# Altium schematic sheet HV Interlock Circuit.SchDoc: Power Distrubition Unit LV
size A4; Date: 5.03.2019; Author: Sedat Kudak; CompanyName: Gunsel; Organization: GÜNSEL; Address1: Near East Boulevard; Address2: 99010; Address3: Lefkosa,TRNC; Address4: www.gunsel.com.tr; SheetNumber: 1; SheetTotal: 1
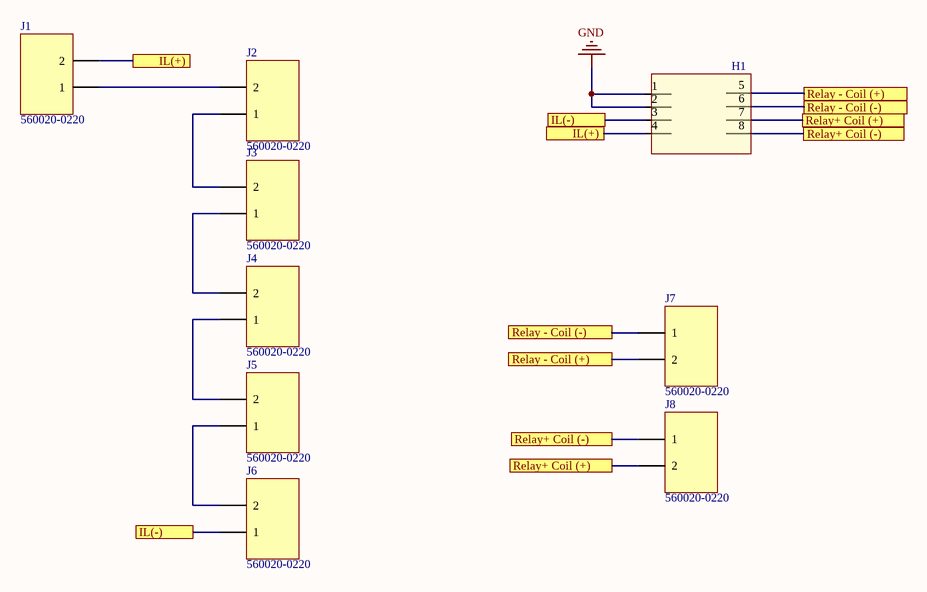
[diagram p0: HV Interlock Circuit.SchDoc]

## Parts
H1  TE-1379684-1  [TE-1379684-1]  (value not drawn)
J1  560020-0220  [560020-0220]
J2  560020-0220  [560020-0220]
J3  560020-0220  [560020-0220]
J4  560020-0220  [560020-0220]
J5  560020-0220  [560020-0220]
J6  560020-0220  [560020-0220]
J7  560020-0220  [560020-0220]
J8  560020-0220  [560020-0220]

## Ports
IL(+), IL(-), Relay - Coil (+), Relay - Coil (-), Relay+ Coil (+), Relay+ Coil (-)

## Nets
GND: H1.1(K) H1.2(K)
IL(+): H1.4(K) J1.2 ; port IL(+)
IL(-): H1.3(K) J6.1 ; port IL(-)
Relay - Coil (+): H1.5(K) J7.2 ; port Relay - Coil (+)
Relay - Coil (-): H1.6(K) J7.1 ; port Relay - Coil (-)
Relay+ Coil (+): H1.7(K) J8.2 ; port Relay+ Coil (+)
Relay+ Coil (-): H1.8(K) J8.1 ; port Relay+ Coil (-)
NetJ1_1: J1.1 J2.2
NetJ2_1: J2.1 J3.2
NetJ3_1: J3.1 J4.2
NetJ4_1: J4.1 J5.2
NetJ5_1: J5.1 J6.2

## Notes on the sheet
- Author:
- Title
- Date:
- Time:
- Checked By:
- Size:
- A4
- Rev:
- /
- File:

## Library data of the parts
J1-J8 = 560020-0220: CONN HEADER SMD 2POS 2MM; Manufacturer: Molex; Number of Positions: 2; Connector Type: Male Pin; Gender: Male; Pitch: 0.079inch; Glow Wire Compliant: Non-compliant; Supplier 1: Digi-Key; Manufacturer Part Number: 560020-0220; Stock 1: 20760; Pricing 1: 1=0.78, 10=0.685, 100=0.5912 (USD); Mount: Surface Mount; Contact Plating: Tin; Color: Natural; Contact Material: Copper Alloy; Number of Rows: 1; Packaging: Tape and Reel; Termination: Solder; Fastening Type: Latch; Number of Contacts: 2; Orientation: Vertical; Number of Circuits: 2; REACH SVHC: Unknown; Supplier Part Number 1: WM10862DKR-ND
H1 = TE-1379684-1: ComponentLink1Description: TE-HEADER ASSY,8w .025 SERIES, R.; ComponentLink1URL: https://www.te.com/usa-en/product-1379684-1.html; ComponentLink2Description: Mouser-Automotive Connectors HEADER ASSY 8w .025 SERIES R. ANGLE; ComponentLink2URL: https://eu.mouser.com/ProductDetail/TE-Connectivity/1379684-1?qs=GQ3BsEl46pnfvp5%2F0fNBmw==